# EAGLE design charger-board (EAGLE 6.4)
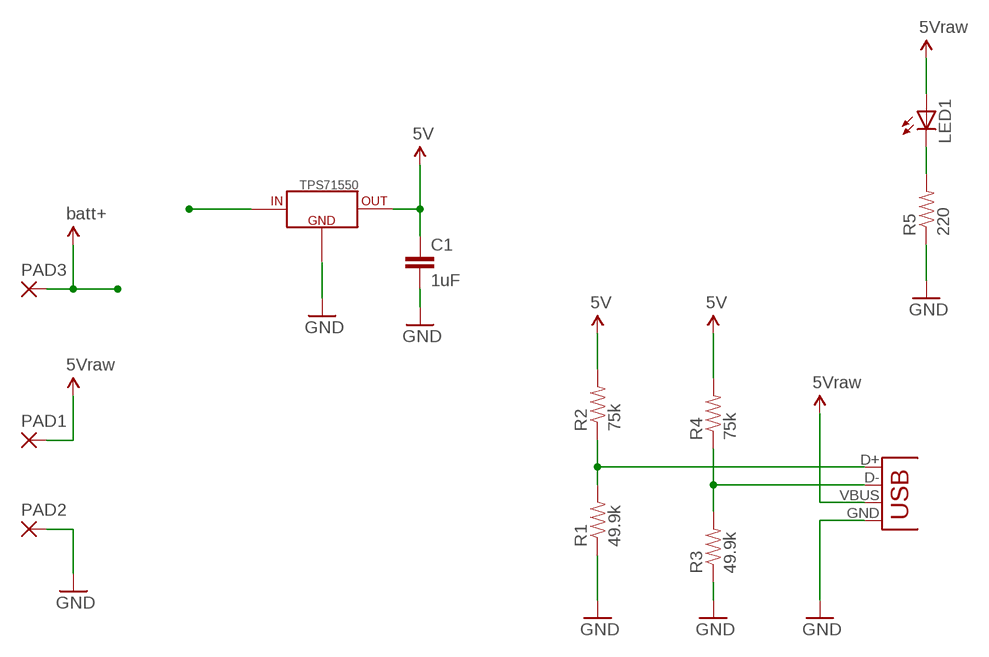
[diagram p0: schematic, sheet 1]

## Parts
C1  1uF  CAP0805  [0805]
JP1  USB-A-S  [USB-A-S]
LED1  LED0603  [LED-0603]
PAD1  WIREPAD2,54/0,8  [2,54/0,8]
PAD2  WIREPAD2,54/0,8  [2,54/0,8]
PAD3  WIREPAD2,54/0,8  [2,54/0,8]
R1  49.9k  RESISTOR0603-RES  [0603-RES]
R2  75k  RESISTOR0603-RES  [0603-RES]
R3  49.9k  RESISTOR0603-RES  [0603-RES]
R4  75k  RESISTOR0603-RES  [0603-RES]
R5  220  RESISTOR0603-RES  [0603-RES]
TPS71550  TPS715XX  [SC70-5]

## Nets
5V: C1.1 R2.2 R4.2 TPS71550.5(OUT)
5VRAW: JP1.VBUS LED1.A PAD1.1(P) ; supply symbol labelled 5Vraw
BATT+: PAD3.1(P) TPS71550.4(IN) ; supply symbol labelled batt+
GND: C1.2 JP1.GND PAD2.1(P) R1.1 R3.1 R5.1 TPS71550.2(GND)
N$1: LED1.C R5.2
N$3: JP1.D- R3.2 R4.1
N$4: JP1.D+ R1.2 R2.1

## Library data of the parts
C1 = SparkFun-Capacitors:CAP: Capacitor Standard 0603 ceramic capacitor, and 0.1" leaded capacitor.
JP1 = SparkFun-Connectors:USB: USB Connectors USB-B-PTH is fully proven SKU : PRT-00139/CONN-08278 USB-miniB is fully proven SKU : PRT-00587 USB-A-PCB is untested. USB-A-H is throughly reviewed, but untested. Spark Fun Electronics SKU : PRT-00437 USB-B-SMT is throughly reviewed, but untested. Needs silkscreen touching up. USB-A-S has not been used/tested USB-MB-H has not been used/tested USB-MICROB has been used. CONN-09505
LED1 = SparkFun-LED:LED: LEDs Standard schematic elements and footprints for 5mm, 3mm, 1206, and 0603 sized LEDs. 5mm - Spark Fun Electronics SKU : COM-00529 (and others)
PAD1-PAD3 = wirepad:WIREPAD: Wire PAD connect wire on PCB
R1-R5 = SparkFun-Passives:RESISTOR: Resistor Basic schematic elements and footprints for 0603, 1206, and PTH resistors.
TPS71550 = Synapseware:TPS715XX: 50 mA, 24 V, 3.2-uA Supply Current Low-Dropout Linear Regulator in SC70 (SOT-323) Package TPS71550DCKR - 5.0V version TPS71533DCKR - 3.3V version TPS71525DCKR - 2.5V version

## Board
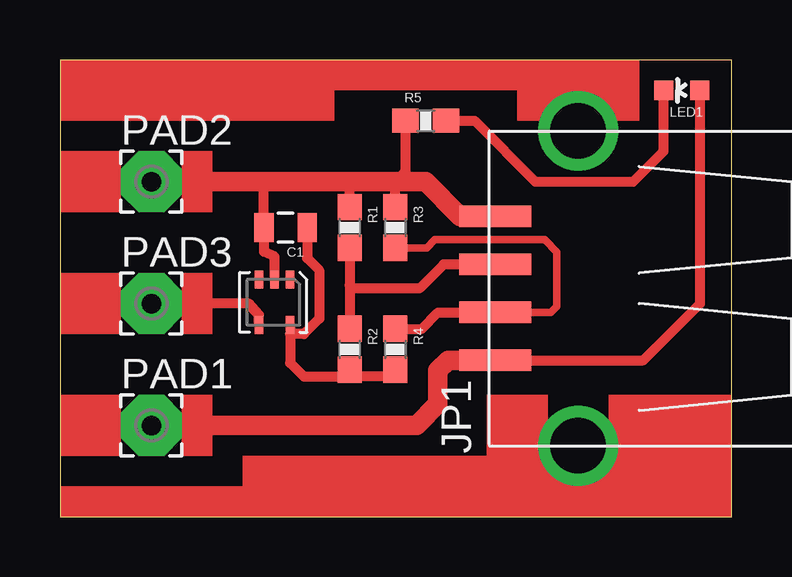
[diagram p1: board, top side]

Size 27.99 x 19.04 mm. Coordinates in mm from the lower left corner, seen from the top.
Outline: 0,0 27.99,0 27.99,19.04 0,19.04 0,0
Copper layers (1*16): Top 0.035mm / dielectric 1.5mm / Bottom 0.035mm
Design rules "default": minimum track width 10mil, minimum drill 0.6mm, track to track 8mil, track to pad 8mil, pad to pad 8mil, via to via 8mil, smd to smd 8mil, copper to edge 40mil, drill to drill 8mil, minimum pad ring 10mil, minimum via ring 8mil, stop-mask expansion 4mil, vias tented up to drill 0mil, thermal gap 10mil

### Footprints (pad centres in the part's own frame; a part is rotated, then mirrored left to right if it is on the bottom)
0805 = smd 0.8 x 1.2: 1 -0.9,0; 2 0.9,0
USB-A-S = smd 3 x 0.9: D+ 3.45,-1; D- 3.45,1; GND 3.45,-3; VBUS 3.45,3 | drill 2.311: P$5 0,-6.566; P$6 0,6.566
LED-0603 = smd 0.8 x 0.8: A 0,-0.75; C 0,0.75
2,54/0,8 = drill 0.813 pad 2.54 octagon: 1 0,0
0603-RES = smd 1.1 x 1: 1 -0.85,0; 2 0.85,0
SC70-5 = smd 0.35 x 0.75: 1 -0.7,-1; 2 -0.05,-1; 3 0.6,-1; 4 0.6,0.9; 5 -0.7,0.9

### Placement (x,y rotation side)
C1  9.4,12.06 180 top
JP1  21.59,9.53 180 top
LED1  25.91,17.78 90 top
PAD1  3.81,3.81 0 top
PAD2  3.81,13.97 0 top
PAD3  3.81,8.89 0 top
R1  12.06,12.06 270 top
R2  12.06,6.99 270 top
R3  13.97,12.06 270 top
R4  13.97,6.99 270 top
R5  15.24,16.51 0 top
TPS71550  8.89,8.89 180 top

### Tracks (layer width: path | path; a pad name or v marks a point on that pad's centre or on a via)
5V
  Top 0.406: TPS71550.5 9.59,7.62 | 9.59,7.62 9.59,6.41 10.16,5.84 12.06,5.84 | 12.06,5.84 R2.2 | R4.2 13.97,5.84 12.06,5.84 | C1.1 10.3,10.78 10.79,10.29 10.81,8.27 10.16,7.62 9.59,7.62
5VRAW
  Top 0.406: JP1.VBUS 24.3,6.53 26.67,8.89 LED1.A
  Top 0.813: JP1.VBUS 16.18,6.53 15.75,6.1 15.75,4.7 14.86,3.81 PAD1.1
BATT+
  Top 0.406: TPS71550.4 8.29,8.42 7.87,8.89 PAD3.1
GND
  Top 0.406: R3.1 13.97,13.97 14.39,14.39 R5.1 | R1.1 12.06,13.97 | 9.4,13.97 8.5,13.96 C1.2 8.51,11.95 8.51,11.05 8.94,10.85 TPS71550.2
  Top 0.813: JP1.GND 16.68,12.53 15.24,13.97 13.97,13.97 12.06,13.97 9.4,13.97 PAD2.1
N$1
  Top 0.406: R5.2 17.27,16.51 19.81,13.97 23.88,13.97 25.15,15.24 25.15,17.77 LED1.C
N$3
  Top 0.305: R3.2 15.28,11.21 15.62,11.56 20.19,11.56 20.7,11.05 20.7,8.76 20.45,8.51 18.16,8.51
  Top 0.406: 18.16,8.51 JP1.D- 18.12,8.51 15.75,8.51 15.07,7.83 R4.1
N$4
  Top 0.406: R1.2 12.06,9.65 | 12.06,9.65 R2.1 | JP1.D+ 15.99,10.53 14.99,9.53 12.19,9.53 12.06,9.65
(copper drawn outside any net)
  shapes: Top area x16